# Altium project 0020-03_FFT2G.PrjPcb
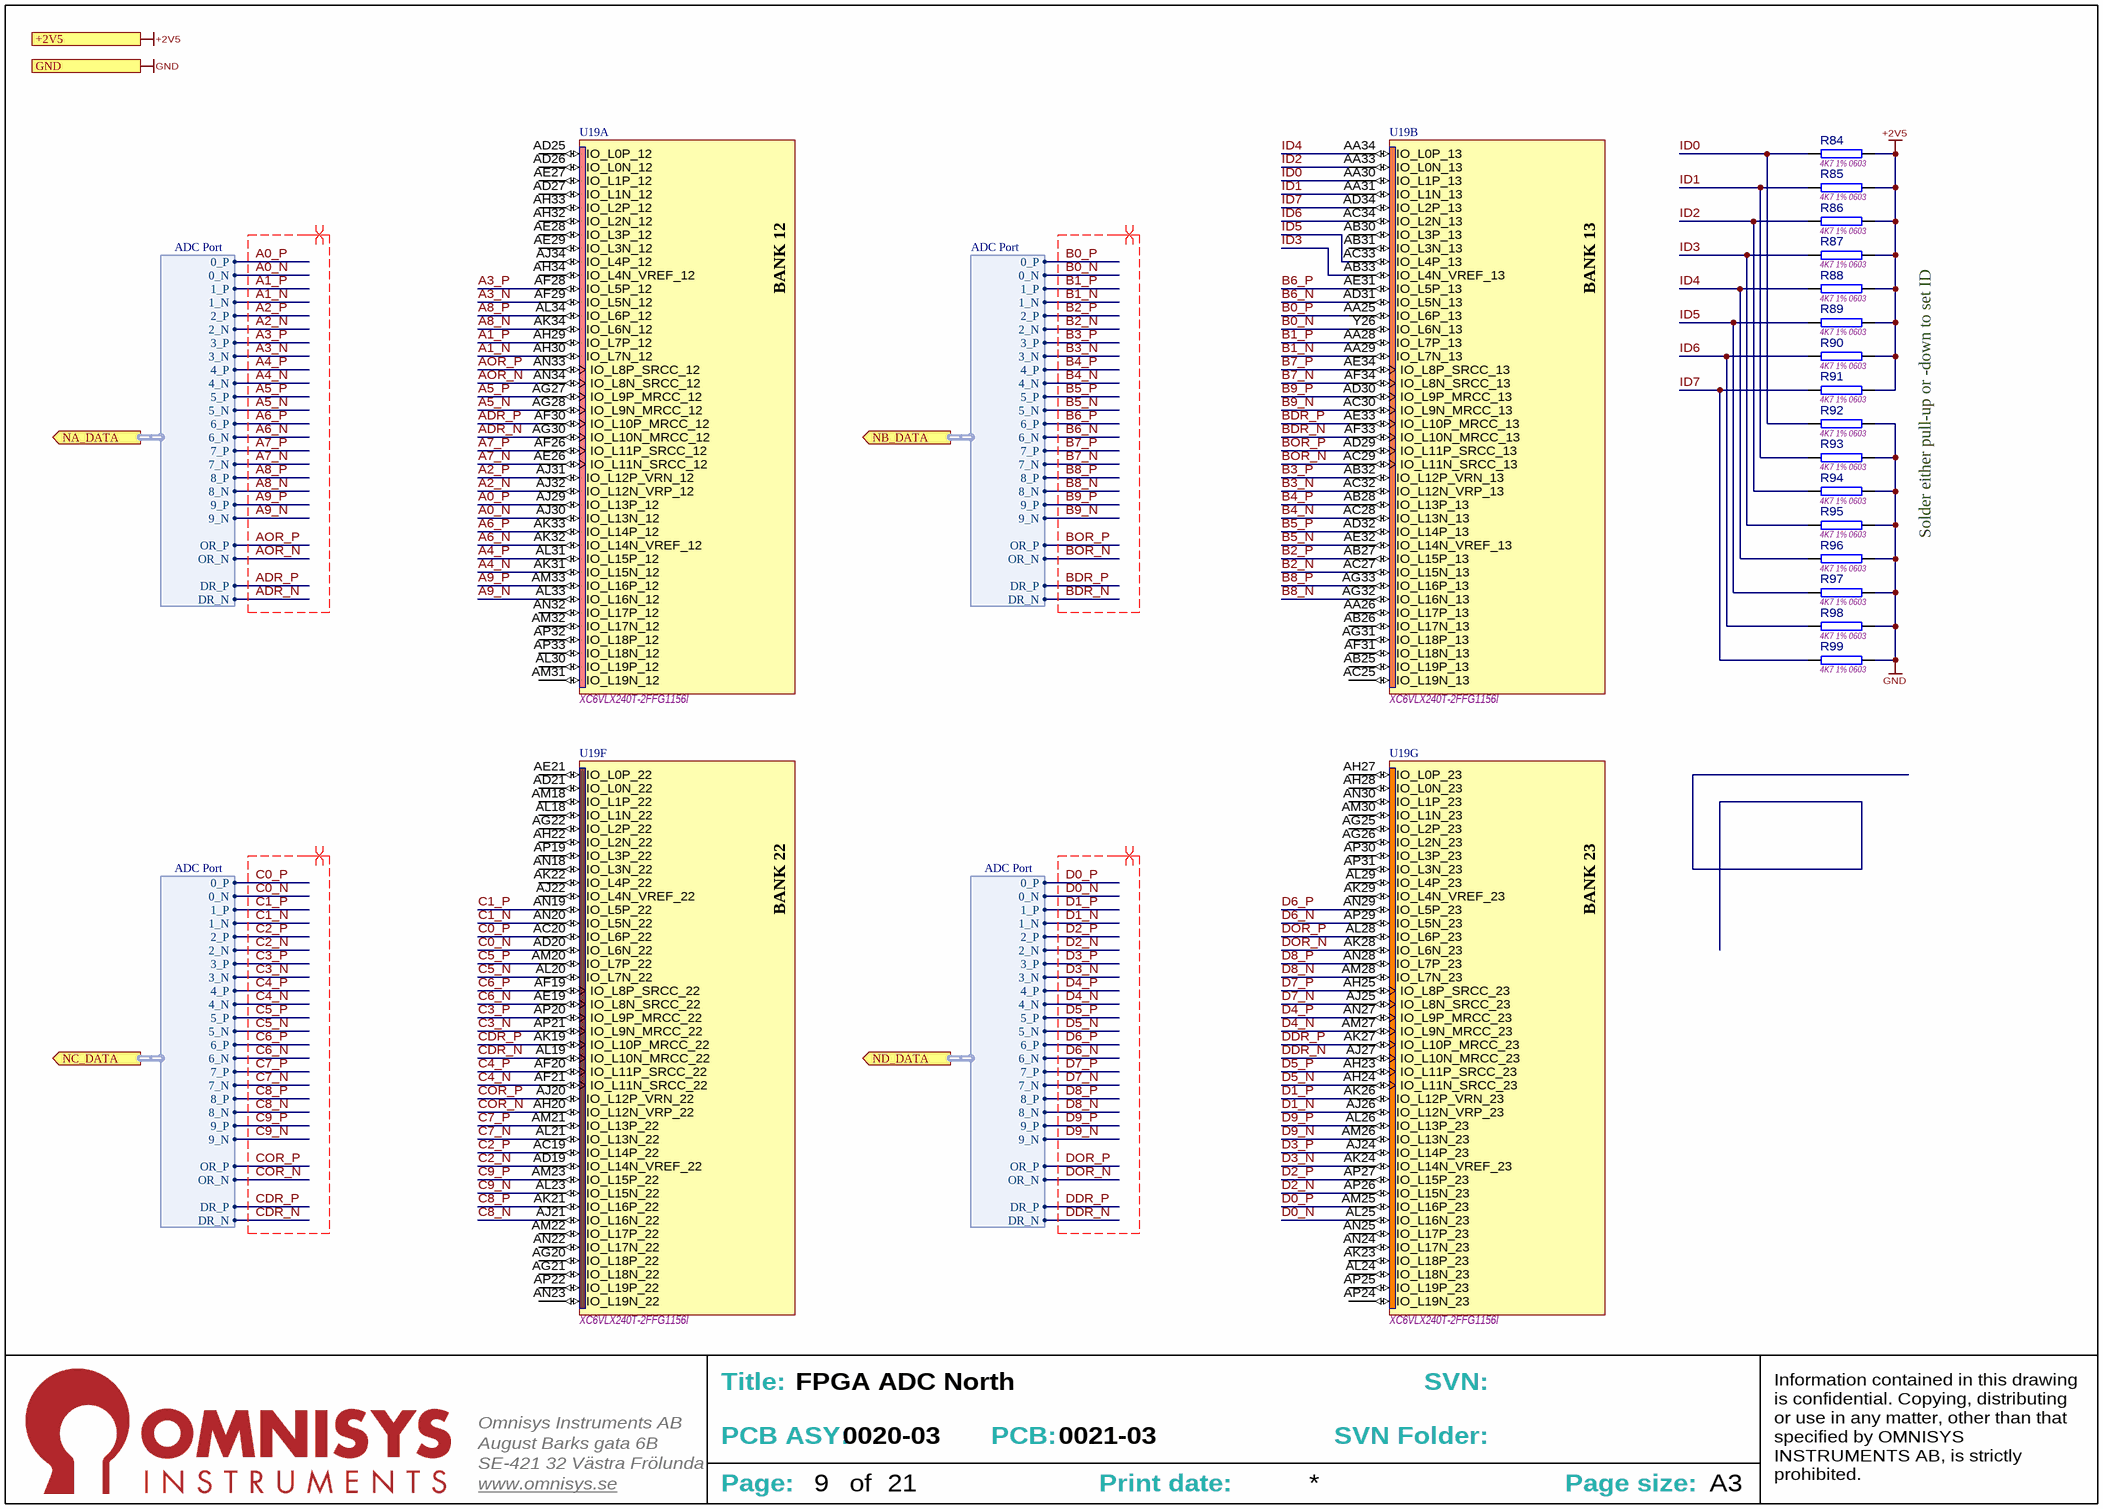
[diagram p0: [9] FPGA_ADC_N.SchDoc]
PCB_Part: 0021-03; PCBASY_Part: 0020-03
4 sheets, 90 parts. Net scope: strictly hierarchical (ports join the sheet entries above them; power ports are local).
Board files: 0020-03_FFT2G.PcbDoc, PCB1.PcbDoc
Sheets:
  [9] FPGA_ADC_N.SchDoc
  [13] FPGA_PWR.SchDoc
  [1] 0020-03_FFT2G - Top.SchDoc
  Sheet1-Renamed123.SchDoc

## Sheet [9] FPGA_ADC_N.SchDoc: FPGA ADC North
size 393 x 281 mm; SheetNumber: 9; SheetTotal: 21; PageSetup: Record=PageOptions|CenterHorizontal=True|CenterVertical=True|PrintScale=0.94|XCorrection=0.00|YCorrection=0.00|PrintKind=0|BorderSize=5000000|LeftOffset=0|BottomOffset=0|Orientation=2|PaperLength=1000|PaperWidth=1000|Scale=100|PaperSource=15|PrintQuality=600|MediaType=1|DitherType=10|PrintScaleMode=1|PaperKind=A4; Adr1: August Barks gata 6B; Adr2: SE-421 32 Västra Frölunda; Adr3: Sweden; Webpage: www.omnisys.se

### Parts
R84  4K7 1% 0603  [RESC1608N]
R85  4K7 1% 0603  [RESC1608N]
R86  4K7 1% 0603  [RESC1608N]
R87  4K7 1% 0603  [RESC1608N]
R88  4K7 1% 0603  [RESC1608N]
R89  4K7 1% 0603  [RESC1608N]
R90  4K7 1% 0603  [RESC1608N]
R91  4K7 1% 0603  [RESC1608N]
R92  4K7 1% 0603  [RESC1608N]
R93  4K7 1% 0603  [RESC1608N]
R94  4K7 1% 0603  [RESC1608N]
R95  4K7 1% 0603  [RESC1608N]
R96  4K7 1% 0603  [RESC1608N]
R97  4K7 1% 0603  [RESC1608N]
R98  4K7 1% 0603  [RESC1608N]
R99  4K7 1% 0603  [RESC1608N]
U19  XC6VLX240T-2FFG1156I  [FFG1156]  (parts A,B,F,G of 20)

### Ports
+2V5, GND, NA_DATA (out, harness ADC Port), NB_DATA (out, harness ADC Port), NC_DATA (out, harness ADC Port), ND_DATA (out, harness ADC Port)

### Harnesses
ADC Port: 0_P, 1_P, 2_P, 3_P, 4_P, 5_P, 6_P, 7_P, 8_P, 9_P, 0_N, 1_N, 2_N, 3_N, 4_N, 5_N, 6_N, 7_N, 8_N, 9_N, OR_P, OR_N, DR_P, DR_N

### Nets
+2V5: R84.1 R85.1 R86.1 R87.1 R88.1 R89.1 R90.1 R91.1 ; port +2V5
GND: R92.1 R93.1 R94.1 R95.1 R96.1 R97.1 R98.1 R99.1 ; port GND
A0_N: U19.AJ30(IO_L13N_12) ; port NA_DATA.0_N
A0_P: U19.AJ29(IO_L13P_12) ; port NA_DATA.0_P
A1_N: U19.AH30(IO_L7N_12) ; port NA_DATA.1_N
A1_P: U19.AH29(IO_L7P_12) ; port NA_DATA.1_P
A2_N: U19.AJ32(IO_L12N_VRP_12) ; port NA_DATA.2_N
A2_P: U19.AJ31(IO_L12P_VRN_12) ; port NA_DATA.2_P
A3_N: U19.AF29(IO_L5N_12) ; port NA_DATA.3_N
A3_P: U19.AF28(IO_L5P_12) ; port NA_DATA.3_P
A4_N: U19.AK31(IO_L15N_12) ; port NA_DATA.4_N
A4_P: U19.AL31(IO_L15P_12) ; port NA_DATA.4_P
A5_N: U19.AG28(IO_L9N_MRCC_12) ; port NA_DATA.5_N
A5_P: U19.AG27(IO_L9P_MRCC_12) ; port NA_DATA.5_P
A6_N: U19.AK32(IO_L14N_VREF_12) ; port NA_DATA.6_N
A6_P: U19.AK33(IO_L14P_12) ; port NA_DATA.6_P
A7_N: U19.AE26(IO_L11N_SRCC_12) ; port NA_DATA.7_N
A7_P: U19.AF26(IO_L11P_SRCC_12) ; port NA_DATA.7_P
A8_N: U19.AK34(IO_L6N_12) ; port NA_DATA.8_N
A8_P: U19.AL34(IO_L6P_12) ; port NA_DATA.8_P
A9_N: U19.AL33(IO_L16N_12) ; port NA_DATA.9_N
A9_P: U19.AM33(IO_L16P_12) ; port NA_DATA.9_P
ADR_N: U19.AG30(IO_L10N_MRCC_12) ; port NA_DATA.DR_N
ADR_P: U19.AF30(IO_L10P_MRCC_12) ; port NA_DATA.DR_P
AOR_N: U19.AN34(IO_L8N_SRCC_12) ; port NA_DATA.OR_N
AOR_P: U19.AN33(IO_L8P_SRCC_12) ; port NA_DATA.OR_P
B0_N: U19.Y26(IO_L6N_13) ; port NB_DATA.0_N
B0_P: U19.AA25(IO_L6P_13) ; port NB_DATA.0_P
B1_N: U19.AA29(IO_L7N_13) ; port NB_DATA.1_N
B1_P: U19.AA28(IO_L7P_13) ; port NB_DATA.1_P
B2_N: U19.AC27(IO_L15N_13) ; port NB_DATA.2_N
B2_P: U19.AB27(IO_L15P_13) ; port NB_DATA.2_P
B3_N: U19.AC32(IO_L12N_VRP_13) ; port NB_DATA.3_N
B3_P: U19.AB32(IO_L12P_VRN_13) ; port NB_DATA.3_P
B4_N: U19.AC28(IO_L13N_13) ; port NB_DATA.4_N
B4_P: U19.AB28(IO_L13P_13) ; port NB_DATA.4_P
B5_N: U19.AE32(IO_L14N_VREF_13) ; port NB_DATA.5_N
B5_P: U19.AD32(IO_L14P_13) ; port NB_DATA.5_P
B6_N: U19.AD31(IO_L5N_13) ; port NB_DATA.6_N
B6_P: U19.AE31(IO_L5P_13) ; port NB_DATA.6_P
B7_N: U19.AF34(IO_L8N_SRCC_13) ; port NB_DATA.7_N
B7_P: U19.AE34(IO_L8P_SRCC_13) ; port NB_DATA.7_P
B8_N: U19.AG32(IO_L16N_13) ; port NB_DATA.8_N
B8_P: U19.AG33(IO_L16P_13) ; port NB_DATA.8_P
B9_N: U19.AC30(IO_L9N_MRCC_13) ; port NB_DATA.9_N
B9_P: U19.AD30(IO_L9P_MRCC_13) ; port NB_DATA.9_P
BDR_N: U19.AF33(IO_L10N_MRCC_13) ; port NB_DATA.DR_N
BDR_P: U19.AE33(IO_L10P_MRCC_13) ; port NB_DATA.DR_P
BOR_N: U19.AC29(IO_L11N_SRCC_13) ; port NB_DATA.OR_N
BOR_P: U19.AD29(IO_L11P_SRCC_13) ; port NB_DATA.OR_P
C0_N: U19.AD20(IO_L6N_22) ; port NC_DATA.0_N
C0_P: U19.AC20(IO_L6P_22) ; port NC_DATA.0_P
C1_N: U19.AN20(IO_L5N_22) ; port NC_DATA.1_N
C1_P: U19.AN19(IO_L5P_22) ; port NC_DATA.1_P
C2_N: U19.AD19(IO_L14N_VREF_22) ; port NC_DATA.2_N
C2_P: U19.AC19(IO_L14P_22) ; port NC_DATA.2_P
C3_N: U19.AP21(IO_L9N_MRCC_22) ; port NC_DATA.3_N
C3_P: U19.AP20(IO_L9P_MRCC_22) ; port NC_DATA.3_P
C4_N: U19.AF21(IO_L11N_SRCC_22) ; port NC_DATA.4_N
C4_P: U19.AF20(IO_L11P_SRCC_22) ; port NC_DATA.4_P
C5_N: U19.AL20(IO_L7N_22) ; port NC_DATA.5_N
C5_P: U19.AM20(IO_L7P_22) ; port NC_DATA.5_P
C6_N: U19.AE19(IO_L8N_SRCC_22) ; port NC_DATA.6_N
C6_P: U19.AF19(IO_L8P_SRCC_22) ; port NC_DATA.6_P
C7_N: U19.AL21(IO_L13N_22) ; port NC_DATA.7_N
C7_P: U19.AM21(IO_L13P_22) ; port NC_DATA.7_P
C8_N: U19.AJ21(IO_L16N_22) ; port NC_DATA.8_N
C8_P: U19.AK21(IO_L16P_22) ; port NC_DATA.8_P
C9_N: U19.AL23(IO_L15N_22) ; port NC_DATA.9_N
C9_P: U19.AM23(IO_L15P_22) ; port NC_DATA.9_P
CDR_N: U19.AL19(IO_L10N_MRCC_22) ; port NC_DATA.DR_N
CDR_P: U19.AK19(IO_L10P_MRCC_22) ; port NC_DATA.DR_P
COR_N: U19.AH20(IO_L12N_VRP_22) ; port NC_DATA.OR_N
COR_P: U19.AJ20(IO_L12P_VRN_22) ; port NC_DATA.OR_P
D0_N: U19.AL25(IO_L16N_23) ; port ND_DATA.0_N
D0_P: U19.AM25(IO_L16P_23) ; port ND_DATA.0_P
D1_N: U19.AJ26(IO_L12N_VRP_23) ; port ND_DATA.1_N
D1_P: U19.AK26(IO_L12P_VRN_23) ; port ND_DATA.1_P
D2_N: U19.AP26(IO_L15N_23) ; port ND_DATA.2_N
D2_P: U19.AP27(IO_L15P_23) ; port ND_DATA.2_P
D3_N: U19.AK24(IO_L14N_VREF_23) ; port ND_DATA.3_N
D3_P: U19.AJ24(IO_L14P_23) ; port ND_DATA.3_P
D4_N: U19.AM27(IO_L9N_MRCC_23) ; port ND_DATA.4_N
D4_P: U19.AN27(IO_L9P_MRCC_23) ; port ND_DATA.4_P
D5_N: U19.AH24(IO_L11N_SRCC_23) ; port ND_DATA.5_N
D5_P: U19.AH23(IO_L11P_SRCC_23) ; port ND_DATA.5_P
D6_N: U19.AP29(IO_L5N_23) ; port ND_DATA.6_N
D6_P: U19.AN29(IO_L5P_23) ; port ND_DATA.6_P
D7_N: U19.AJ25(IO_L8N_SRCC_23) ; port ND_DATA.7_N
D7_P: U19.AH25(IO_L8P_SRCC_23) ; port ND_DATA.7_P
D8_N: U19.AM28(IO_L7N_23) ; port ND_DATA.8_N
D8_P: U19.AN28(IO_L7P_23) ; port ND_DATA.8_P
D9_N: U19.AM26(IO_L13N_23) ; port ND_DATA.9_N
D9_P: U19.AL26(IO_L13P_23) ; port ND_DATA.9_P
DDR_N: U19.AJ27(IO_L10N_MRCC_23) ; port ND_DATA.DR_N
DDR_P: U19.AK27(IO_L10P_MRCC_23) ; port ND_DATA.DR_P
DOR_N: U19.AK28(IO_L6N_23) ; port ND_DATA.OR_N
DOR_P: U19.AL28(IO_L6P_23) ; port ND_DATA.OR_P
ID0: R84.2 R92.2 U19.AA30(IO_L1P_13)
ID1: R85.2 R93.2 U19.AA31(IO_L1N_13)
ID2: R86.2 R94.2 U19.AA33(IO_L0N_13)
ID3: R87.2 R95.2 U19.AB33(IO_L4N_VREF_13)
ID4: R88.2 R96.2 U19.AA34(IO_L0P_13)
ID5: R89.2 R97.2 U19.AC33(IO_L4P_13)
ID6: R90.2 R98.2 U19.AC34(IO_L2N_13)
ID7: R91.2 R99.2 U19.AD34(IO_L2P_13)

Not connected (* = marked no-connect by the designer): U19 AA26(IO_L17P_13) AB25(IO_L19P_13) AB26(IO_L17N_13) AB30(IO_L3P_13) AB31(IO_L3N_13) AC25(IO_L19N_13) AD21(IO_L0N_22) AD25(IO_L0P_12) AD26(IO_L0N_12) AD27(IO_L1N_12) AE21(IO_L0P_22) AE27(IO_L1P_12) AE28(IO_L3P_12) AE29(IO_L3N_12) AF31(IO_L18N_13) AG20(IO_L18P_22) AG21(IO_L18N_22) AG22(IO_L2P_22) AG25(IO_L2P_23) AG26(IO_L2N_23) AG31(IO_L18P_13) AH22(IO_L2N_22) AH27(IO_L0P_23) AH28(IO_L0N_23) AH32(IO_L2N_12) AH33(IO_L2P_12) AH34(IO_L4N_VREF_12) AJ22(IO_L4N_VREF_22) AJ34(IO_L4P_12) AK22(IO_L4P_22) AK23(IO_L18P_23) AK29(IO_L4N_VREF_23) AL18(IO_L1N_22) AL24(IO_L18N_23) AL29(IO_L4P_23) AL30(IO_L19P_12) AM18(IO_L1P_22) AM22(IO_L17P_22) AM30(IO_L1N_23) AM31(IO_L19N_12) AM32(IO_L17N_12) AN18(IO_L3N_22) AN22(IO_L17N_22) AN23(IO_L19N_22) AN24(IO_L17N_23) AN25(IO_L17P_23) AN30(IO_L1P_23) AN32(IO_L17P_12) AP19(IO_L3P_22) AP22(IO_L19P_22) AP24(IO_L19N_23) AP25(IO_L19P_23) AP30(IO_L3P_23) AP31(IO_L3N_23) AP32(IO_L18P_12) AP33(IO_L18N_12)

### Layout directives
differential pair; rule Differential Pairs Routing [Pref Gap = 0.1mm    Min Gap  = 0.1mm    Max Gap  = 0.1mmPref Width = 0.1mm    Min Width  = 0.1mm    Max Width  = 0.1mm]; net class DiffPairs_FPGA: A0_N, A0_P, A1_N, A1_P, A2_N, A2_P, A3_N, A3_P, A4_N, A4_P, A5_N, A5_P, A6_N, A6_P, A7_N, A7_P, A8_N, A8_P, A9_N, A9_P, ADR_N, ADR_P, AOR_N, AOR_P, B0_N, B0_P, B1_N, B1_P, B2_N, B2_P, B3_N, B3_P, B4_N, B4_P, B5_N, B5_P, B6_N, B6_P, B7_N, B7_P, B8_N, B8_P, B9_N, B9_P, BDR_N, BDR_P, BOR_N, BOR_P, C0_N, C0_P, C1_N, C1_P, C2_N, C2_P, C3_N, C3_P, C4_N, C4_P, C5_N, C5_P, C6_N, C6_P, C7_N, C7_P, C8_N, C8_P, C9_N, C9_P, CDR_N, CDR_P, COR_N, COR_P, D0_N, D0_P, D1_N, D1_P, D2_N, D2_P, D3_N, D3_P, D4_N, D4_P, D5_N, D5_P, D6_N, D6_P, D7_N, D7_P, D8_N, D8_P, D9_N, D9_P, DDR_N, DDR_P, DOR_N, DOR_P

### Notes on the sheet
- Solder either pull-up or -down to set ID
- Title:
- SVN:
- August Barks gata 6B
- SE-421 32 Västra Frölunda
- Omnisys Instruments AB
- PCB ASY:
- PCB:
- SVN Folder:
- www.omnisys.se
- Page:
- of
- Print date:
- Page size:
- A3
- Information contained in this drawing is confidential. Copying, distributing or use in any matter, other than that specified by OMNISYS INSTRUMENTS AB, is strictly prohibited.
- (in symbol CMP-2100-000586-1, part A) BANK 12
- (in symbol CMP-2100-000586-1, part B) BANK 13
- (in symbol CMP-2100-000586-1, part F) BANK 22
- (in symbol CMP-2100-000586-1, part G) BANK 23

### Library data of the parts
R84-R99 = CMP-1800-002037-5: Thick film Chip Resistor, 0603/1608; Value: 4.7k; Power: 100mW; Maximum working voltage: 75V; Temp. Coefficent: 0.01%; Tolerance: 1%; Case/Package: 0603/1608; Composition: Thick film
U19 = CMP-2100-000586-1: FPGA Virtex-6 LXT Family 241152 Cells 40nm (CMOS) Technology 1V 1156-Pin FCBGA; Number of I/Os: 600; Number of Logic Blocks (LABs): 18840; Number of Logic Elements/Cells: 241152; RAM Size: 15335424b; Speed Grade: 2; Case/Package: FCBGA; Max Operating Temperature: 100°C; Min Operating Temperature: -40°C; Mount: Surface Mount; Number of Pins: 1156; Operating Supply Voltage: 1V; Package Quantity: 1

## Sheet [13] FPGA_PWR.SchDoc: FPGA Power
size 393 x 281 mm; SheetNumber: 13; SheetTotal: 21; PageSetup: Record=PageOptions|CenterHorizontal=True|CenterVertical=True|PrintScale=0.94|XCorrection=0.00|YCorrection=0.00|PrintKind=0|BorderSize=5000000|LeftOffset=0|BottomOffset=0|Orientation=2|PaperLength=1000|PaperWidth=1000|Scale=100|PaperSource=15|PrintQuality=600|MediaType=1|DitherType=10|PrintScaleMode=1|PaperKind=A4; Adr1: August Barks gata 6B; Adr2: SE-421 32 Västra Frölunda; Adr3: Sweden; Webpage: www.omnisys.se
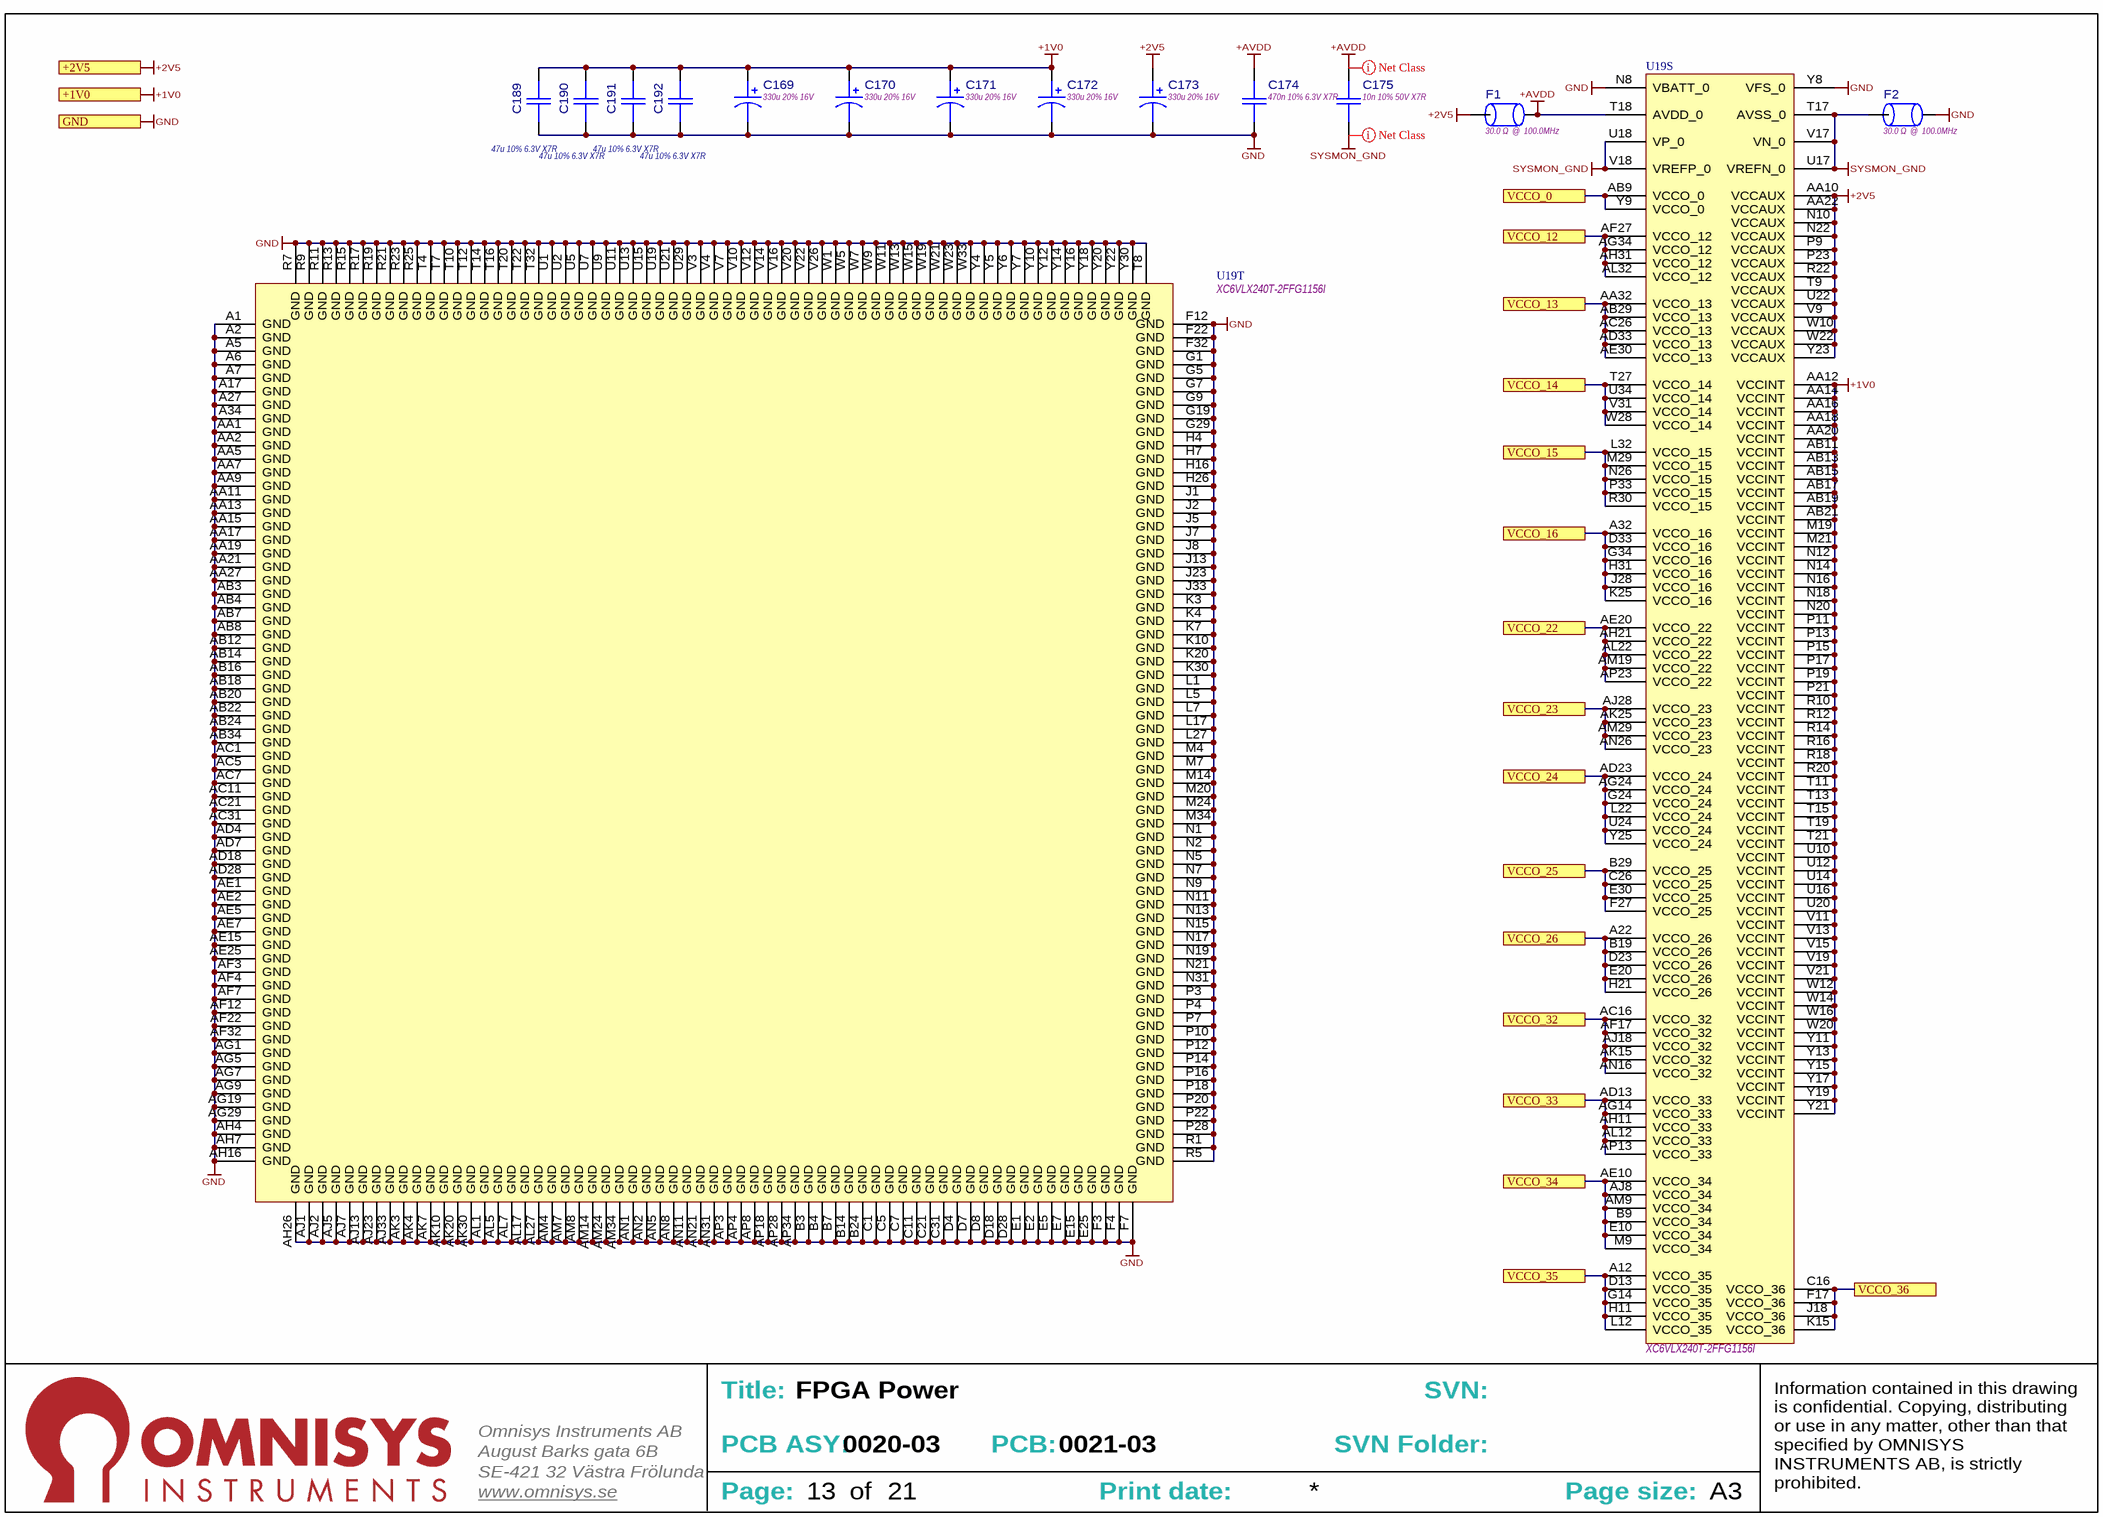
[diagram p1: [13] FPGA_PWR.SchDoc]

### Parts
C169  330u 20% 16V  [CAPMP7343X43N]
C170  330u 20% 16V  [CAPMP7343X43N]
C171  330u 20% 16V  [CAPMP7343X43N]
C172  330u 20% 16V  [CAPMP7343X43N]
C173  330u 20% 16V  [CAPMP7343X43N]
C174  470n 10% 6.3V X7R  [CAPC1608X90N]
C175  10n 10% 50V X7R  [CAPC1608X90N]
C189  47u 10% 6.3V X7R  [CAPC3225X270N]
C190  47u 10% 6.3V X7R  [CAPC3225X270N]
C191  47u 10% 6.3V X7R  [CAPC3225X270N]
C192  47u 10% 6.3V X7R  [CAPC3225X270N]
F1  30.0 Ω  @  100.0MHz  [INDC2012X11L]
F2  30.0 Ω  @  100.0MHz  [INDC2012X11L]
U19  XC6VLX240T-2FFG1156I  [FFG1156]  (parts S,T of 20)

### Ports
+1V0, +2V5, GND, VCCO_0, VCCO_12, VCCO_13, VCCO_14, VCCO_15, VCCO_16, VCCO_22, VCCO_23, VCCO_24, VCCO_25, VCCO_26, VCCO_32, VCCO_33, VCCO_34, VCCO_35, VCCO_36

### Nets
+1V0: C169.1 C170.1 C171.1 C172.1 C189.1 C190.1 C191.1 C192.1 U19.AA12(VCCINT) U19.AA14(VCCINT) U19.AA16(VCCINT) U19.AA18(VCCINT) U19.AA20(VCCINT) U19.AB11(VCCINT) U19.AB13(VCCINT) U19.AB15(VCCINT) U19.AB17(VCCINT) U19.AB19(VCCINT) U19.AB21(VCCINT) U19.M19(VCCINT) U19.M21(VCCINT) U19.N12(VCCINT) U19.N14(VCCINT) U19.N16(VCCINT) U19.N18(VCCINT) U19.N20(VCCINT) U19.P11(VCCINT) U19.P13(VCCINT) U19.P15(VCCINT) U19.P17(VCCINT) U19.P19(VCCINT) U19.P21(VCCINT) U19.R10(VCCINT) U19.R12(VCCINT) U19.R14(VCCINT) U19.R16(VCCINT) U19.R18(VCCINT) U19.R20(VCCINT) U19.T11(VCCINT) U19.T13(VCCINT) U19.T15(VCCINT) U19.T19(VCCINT) U19.T21(VCCINT) U19.U10(VCCINT) U19.U12(VCCINT) U19.U14(VCCINT) U19.U16(VCCINT) U19.U20(VCCINT) U19.V11(VCCINT) U19.V13(VCCINT) U19.V15(VCCINT) U19.V19(VCCINT) U19.V21(VCCINT) U19.W12(VCCINT) U19.W14(VCCINT) U19.W16(VCCINT) U19.W20(VCCINT) U19.Y11(VCCINT) U19.Y13(VCCINT) U19.Y15(VCCINT) U19.Y17(VCCINT) U19.Y19(VCCINT) U19.Y21(VCCINT) ; port +1V0
+2V5: C173.1 F1.1 U19.AA10(VCCAUX) U19.AA22(VCCAUX) U19.N10(VCCAUX) U19.N22(VCCAUX) U19.P9(VCCAUX) U19.P23(VCCAUX) U19.R22(VCCAUX) U19.T9(VCCAUX) U19.U22(VCCAUX) U19.V9(VCCAUX) U19.W10(VCCAUX) U19.W22(VCCAUX) U19.Y23(VCCAUX) ; port +2V5
+AVDD: C174.1 C175.1 F1.2 U19.T18(AVDD_0)
GND: C169.2 C170.2 C171.2 C172.2 C173.2 C174.2 C189.2 C190.2 C191.2 C192.2 F2.2 U19.A1(GND) U19.A2(GND) U19.A5(GND) U19.A6(GND) U19.A7(GND) U19.A17(GND) U19.A27(GND) U19.A34(GND) U19.AA1(GND) U19.AA2(GND) U19.AA5(GND) U19.AA7(GND) U19.AA9(GND) U19.AA11(GND) U19.AA13(GND) U19.AA15(GND) U19.AA17(GND) U19.AA19(GND) U19.AA21(GND) U19.AA27(GND) U19.AB3(GND) U19.AB4(GND) U19.AB7(GND) U19.AB8(GND) U19.AB12(GND) U19.AB14(GND) U19.AB16(GND) U19.AB18(GND) U19.AB20(GND) U19.AB22(GND) U19.AB24(GND) U19.AB34(GND) U19.AC1(GND) U19.AC5(GND) U19.AC7(GND) U19.AC11(GND) U19.AC21(GND) U19.AC31(GND) U19.AD4(GND) U19.AD7(GND) U19.AD18(GND) U19.AD28(GND) U19.AE1(GND) U19.AE2(GND) U19.AE5(GND) U19.AE7(GND) U19.AE15(GND) U19.AE25(GND) U19.AF3(GND) U19.AF4(GND) U19.AF7(GND) U19.AF12(GND) U19.AF22(GND) U19.AF32(GND) U19.AG1(GND) U19.AG5(GND) U19.AG7(GND) U19.AG9(GND) U19.AG19(GND) U19.AG29(GND) U19.AH4(GND) U19.AH7(GND) U19.AH16(GND) U19.AH26(GND) U19.AJ1(GND) U19.AJ2(GND) U19.AJ5(GND) U19.AJ7(GND) U19.AJ13(GND) U19.AJ23(GND) U19.AJ33(GND) U19.AK3(GND) U19.AK4(GND) U19.AK7(GND) U19.AK10(GND) U19.AK20(GND) U19.AK30(GND) U19.AL1(GND) U19.AL5(GND) U19.AL7(GND) U19.AL17(GND) U19.AL27(GND) U19.AM4(GND) U19.AM7(GND) U19.AM8(GND) U19.AM14(GND) U19.AM24(GND) U19.AM34(GND) U19.AN1(GND) U19.AN2(GND) U19.AN5(GND) U19.AN8(GND) U19.AN11(GND) U19.AN21(GND) U19.AN31(GND) U19.AP3(GND) U19.AP4(GND) U19.AP8(GND) U19.AP18(GND) U19.AP28(GND) U19.AP34(GND) U19.B3(GND) U19.B4(GND) U19.B7(GND) U19.B14(GND) U19.B24(GND) U19.C1(GND) U19.C5(GND) U19.C7(GND) U19.C11(GND) U19.C21(GND) U19.C31(GND) U19.D4(GND) U19.D7(GND) U19.D8(GND) U19.D18(GND) U19.D28(GND) U19.E1(GND) U19.E2(GND) U19.E5(GND) U19.E7(GND) U19.E15(GND) U19.E25(GND) U19.F3(GND) U19.F4(GND) U19.F7(GND) U19.F12(GND) U19.F22(GND) U19.F32(GND) U19.G1(GND) U19.G5(GND) U19.G7(GND) U19.G9(GND) U19.G19(GND) U19.G29(GND) U19.H4(GND) U19.H7(GND) U19.H16(GND) U19.H26(GND) U19.J1(GND) U19.J2(GND) U19.J5(GND) U19.J7(GND) U19.J8(GND) U19.J13(GND) U19.J23(GND) U19.J33(GND) U19.K3(GND) U19.K4(GND) U19.K7(GND) U19.K10(GND) U19.K20(GND) U19.K30(GND) U19.L1(GND) U19.L5(GND) U19.L7(GND) U19.L17(GND) U19.L27(GND) U19.M4(GND) U19.M7(GND) U19.M14(GND) U19.M20(GND) U19.M24(GND) U19.M34(GND) U19.N1(GND) U19.N2(GND) U19.N5(GND) U19.N7(GND) U19.N8(VBATT_0) U19.N9(GND) U19.N11(GND) U19.N13(GND) U19.N15(GND) U19.N17(GND) U19.N19(GND) U19.N21(GND) U19.N31(GND) U19.P3(GND) U19.P4(GND) U19.P7(GND) U19.P10(GND) U19.P12(GND) U19.P14(GND) U19.P16(GND) U19.P18(GND) U19.P20(GND) U19.P22(GND) U19.P28(GND) U19.R1(GND) U19.R5(GND) U19.R7(GND) U19.R9(GND) U19.R11(GND) U19.R13(GND) U19.R15(GND) U19.R17(GND) U19.R19(GND) U19.R21(GND) U19.R23(GND) U19.R25(GND) U19.T4(GND) U19.T7(GND) U19.T8(GND) U19.T10(GND) U19.T12(GND) U19.T14(GND) U19.T16(GND) U19.T20(GND) U19.T22(GND) U19.T32(GND) U19.U1(GND) U19.U2(GND) U19.U5(GND) U19.U7(GND) U19.U9(GND) U19.U11(GND) U19.U13(GND) U19.U15(GND) U19.U19(GND) U19.U21(GND) U19.U29(GND) U19.V3(GND) U19.V4(GND) U19.V7(GND) U19.V10(GND) U19.V12(GND) U19.V14(GND) U19.V16(GND) U19.V20(GND) U19.V22(GND) U19.V26(GND) U19.W1(GND) U19.W5(GND) U19.W7(GND) U19.W9(GND) U19.W11(GND) U19.W13(GND) U19.W15(GND) U19.W19(GND) U19.W21(GND) U19.W23(GND) U19.W33(GND) U19.Y4(GND) U19.Y5(GND) U19.Y6(GND) U19.Y7(GND) U19.Y8(VFS_0) U19.Y10(GND) U19.Y12(GND) U19.Y14(GND) U19.Y16(GND) U19.Y18(GND) U19.Y20(GND) U19.Y22(GND) U19.Y30(GND) ; port GND
SYSMON_GND: C175.2 F2.1 U19.T17(AVSS_0) U19.U17(VREFN_0) U19.U18(VP_0) U19.V17(VN_0) U19.V18(VREFP_0)
NetU19_A12: U19.A12(VCCO_35) U19.D13(VCCO_35) U19.G14(VCCO_35) U19.H11(VCCO_35) U19.L12(VCCO_35) ; port VCCO_35
NetU19_A22: U19.A22(VCCO_26) U19.B19(VCCO_26) U19.D23(VCCO_26) U19.E20(VCCO_26) U19.H21(VCCO_26) ; port VCCO_26
NetU19_A32: U19.A32(VCCO_16) U19.D33(VCCO_16) U19.G34(VCCO_16) U19.H31(VCCO_16) U19.J28(VCCO_16) U19.K25(VCCO_16) ; port VCCO_16
NetU19_AA32: U19.AA32(VCCO_13) U19.AB29(VCCO_13) U19.AC26(VCCO_13) U19.AD33(VCCO_13) U19.AE30(VCCO_13) ; port VCCO_13
NetU19_AB9: U19.AB9(VCCO_0) U19.Y9(VCCO_0) ; port VCCO_0
NetU19_AC16: U19.AC16(VCCO_32) U19.AF17(VCCO_32) U19.AJ18(VCCO_32) U19.AK15(VCCO_32) U19.AN16(VCCO_32) ; port VCCO_32
NetU19_AD13: U19.AD13(VCCO_33) U19.AG14(VCCO_33) U19.AH11(VCCO_33) U19.AL12(VCCO_33) U19.AP13(VCCO_33) ; port VCCO_33
NetU19_AD23: U19.AD23(VCCO_24) U19.AG24(VCCO_24) U19.G24(VCCO_24) U19.L22(VCCO_24) U19.U24(VCCO_24) U19.Y25(VCCO_24) ; port VCCO_24
NetU19_AE10: U19.AE10(VCCO_34) U19.AJ8(VCCO_34) U19.AM9(VCCO_34) U19.B9(VCCO_34) U19.E10(VCCO_34) U19.M9(VCCO_34) ; port VCCO_34
NetU19_AE20: U19.AE20(VCCO_22) U19.AH21(VCCO_22) U19.AL22(VCCO_22) U19.AM19(VCCO_22) U19.AP23(VCCO_22) ; port VCCO_22
NetU19_AF27: U19.AF27(VCCO_12) U19.AG34(VCCO_12) U19.AH31(VCCO_12) U19.AL32(VCCO_12) ; port VCCO_12
NetU19_AJ28: U19.AJ28(VCCO_23) U19.AK25(VCCO_23) U19.AM29(VCCO_23) U19.AN26(VCCO_23) ; port VCCO_23
NetU19_B29: U19.B29(VCCO_25) U19.C26(VCCO_25) U19.E30(VCCO_25) U19.F27(VCCO_25) ; port VCCO_25
NetU19_C16: U19.C16(VCCO_36) U19.F17(VCCO_36) U19.J18(VCCO_36) U19.K15(VCCO_36) ; port VCCO_36
NetU19_L32: U19.L32(VCCO_15) U19.M29(VCCO_15) U19.N26(VCCO_15) U19.P33(VCCO_15) U19.R30(VCCO_15) ; port VCCO_15
NetU19_T27: U19.T27(VCCO_14) U19.U34(VCCO_14) U19.V31(VCCO_14) U19.W28(VCCO_14) ; port VCCO_14

### Layout directives
net class Power: +AVDD, SYSMON_GND

### Notes on the sheet
- Title:
- SVN:
- August Barks gata 6B
- SE-421 32 Västra Frölunda
- Omnisys Instruments AB
- PCB ASY:
- PCB:
- SVN Folder:
- www.omnisys.se
- Page:
- of
- Print date:
- Page size:
- A3
- Information contained in this drawing is confidential. Copying, distributing or use in any matter, other than that specified by OMNISYS INSTRUMENTS AB, is strictly prohibited.

### Library data of the parts
C169-C173 = CMP-0300-000208-8: Standard tantalum capacitor, 7343/Case E; ESR: 0.4; Capacitance: 330µF; DCL: 52.8A; DF: 30%; Tolerance: 20%; Rated Voltage: 16V; Case/Package: 7343
C174 = CMP-0300-002107-6: Ceramic Chip Capacitor, 0603/1608; Capacitance: 470nF; Package: 1608/0603; Temperature Charateristics: X7R; Tolerance: 10%; Rated Voltage: 6.3V; Thickness: 900µm; Weight: 9mg
C175 = CMP-0300-002475-6: Ceramic Chip Capacitor, 0603/1608; Temperature Charateristics: C0G; Tolerance: 5%; Capacitance: 10nF; Package: 1608/0603; Rated Voltage: 50V; Thickness: 900µm; Weight: 9mg
C189-C192 = CMP-0300-002062-5: Ceramic Chip Capacitor, 1210/3225; Capacitance: 47µF; Temperature Charateristics: X7R; Tolerance: 10%; Thickness: 2.7mm; Case/Package: 1210/3225; Rated Voltage: 6.3V
F1 F2 = CMP-0600-000010-2: Ferrite bead, Würth Elektronik WE-CBF 2012 (0805), 74279206 ,  30.0 Ω  @  100.0MHz; Zmax@Freq: 55.0 Ω  @      1.0 GHz; Type: High Current; RDC: 25.0 mΩ; IDC: 3.0 A; Z@Freq: 30.0 Ω  @  100.0MHz; PartNumber: 74279206
U19 = CMP-2100-000586-1: as U19 on sheet [9] FPGA_ADC_N; Case/Package: FCBGA; Max Operating Temperature: 100°C; Min Operating Temperature: -40°C; Mount: Surface Mount; Number of Pins: 1156; Operating Supply Voltage: 1V; Package Quantity: 1

## Sheet [1] 0020-03_FFT2G - Top.SchDoc: FFT-Top
size 393 x 281 mm; Notes: No notes; Part_And_Rev: 0000-00; Drawing_Configuration: No Configuration; SheetNumber: 1; SheetTotal: 21; CompanyName: Omnisys Instruments AB; DrawnBy: Enter Name; PageSetup: Record=PageOptions|CenterHorizontal=True|CenterVertical=True|PrintScale=0.94|XCorrection=0.00|YCorrection=0.00|PrintKind=0|BorderSize=5000000|LeftOffset=0|BottomOffset=0|Orientation=2|PaperLength=1000|PaperWidth=1000|Scale=100|PaperSource=15|PrintQuality=-3|MediaType=1|DitherType=10|PrintScaleMode=1|PaperKind=10" x 14"|PaperIndex=16; Adr1: August Barks gata 6B; Adr2: SE-421 32 Västra Frölunda; Adr3: Sweden; Webpage: www.omnisys.se
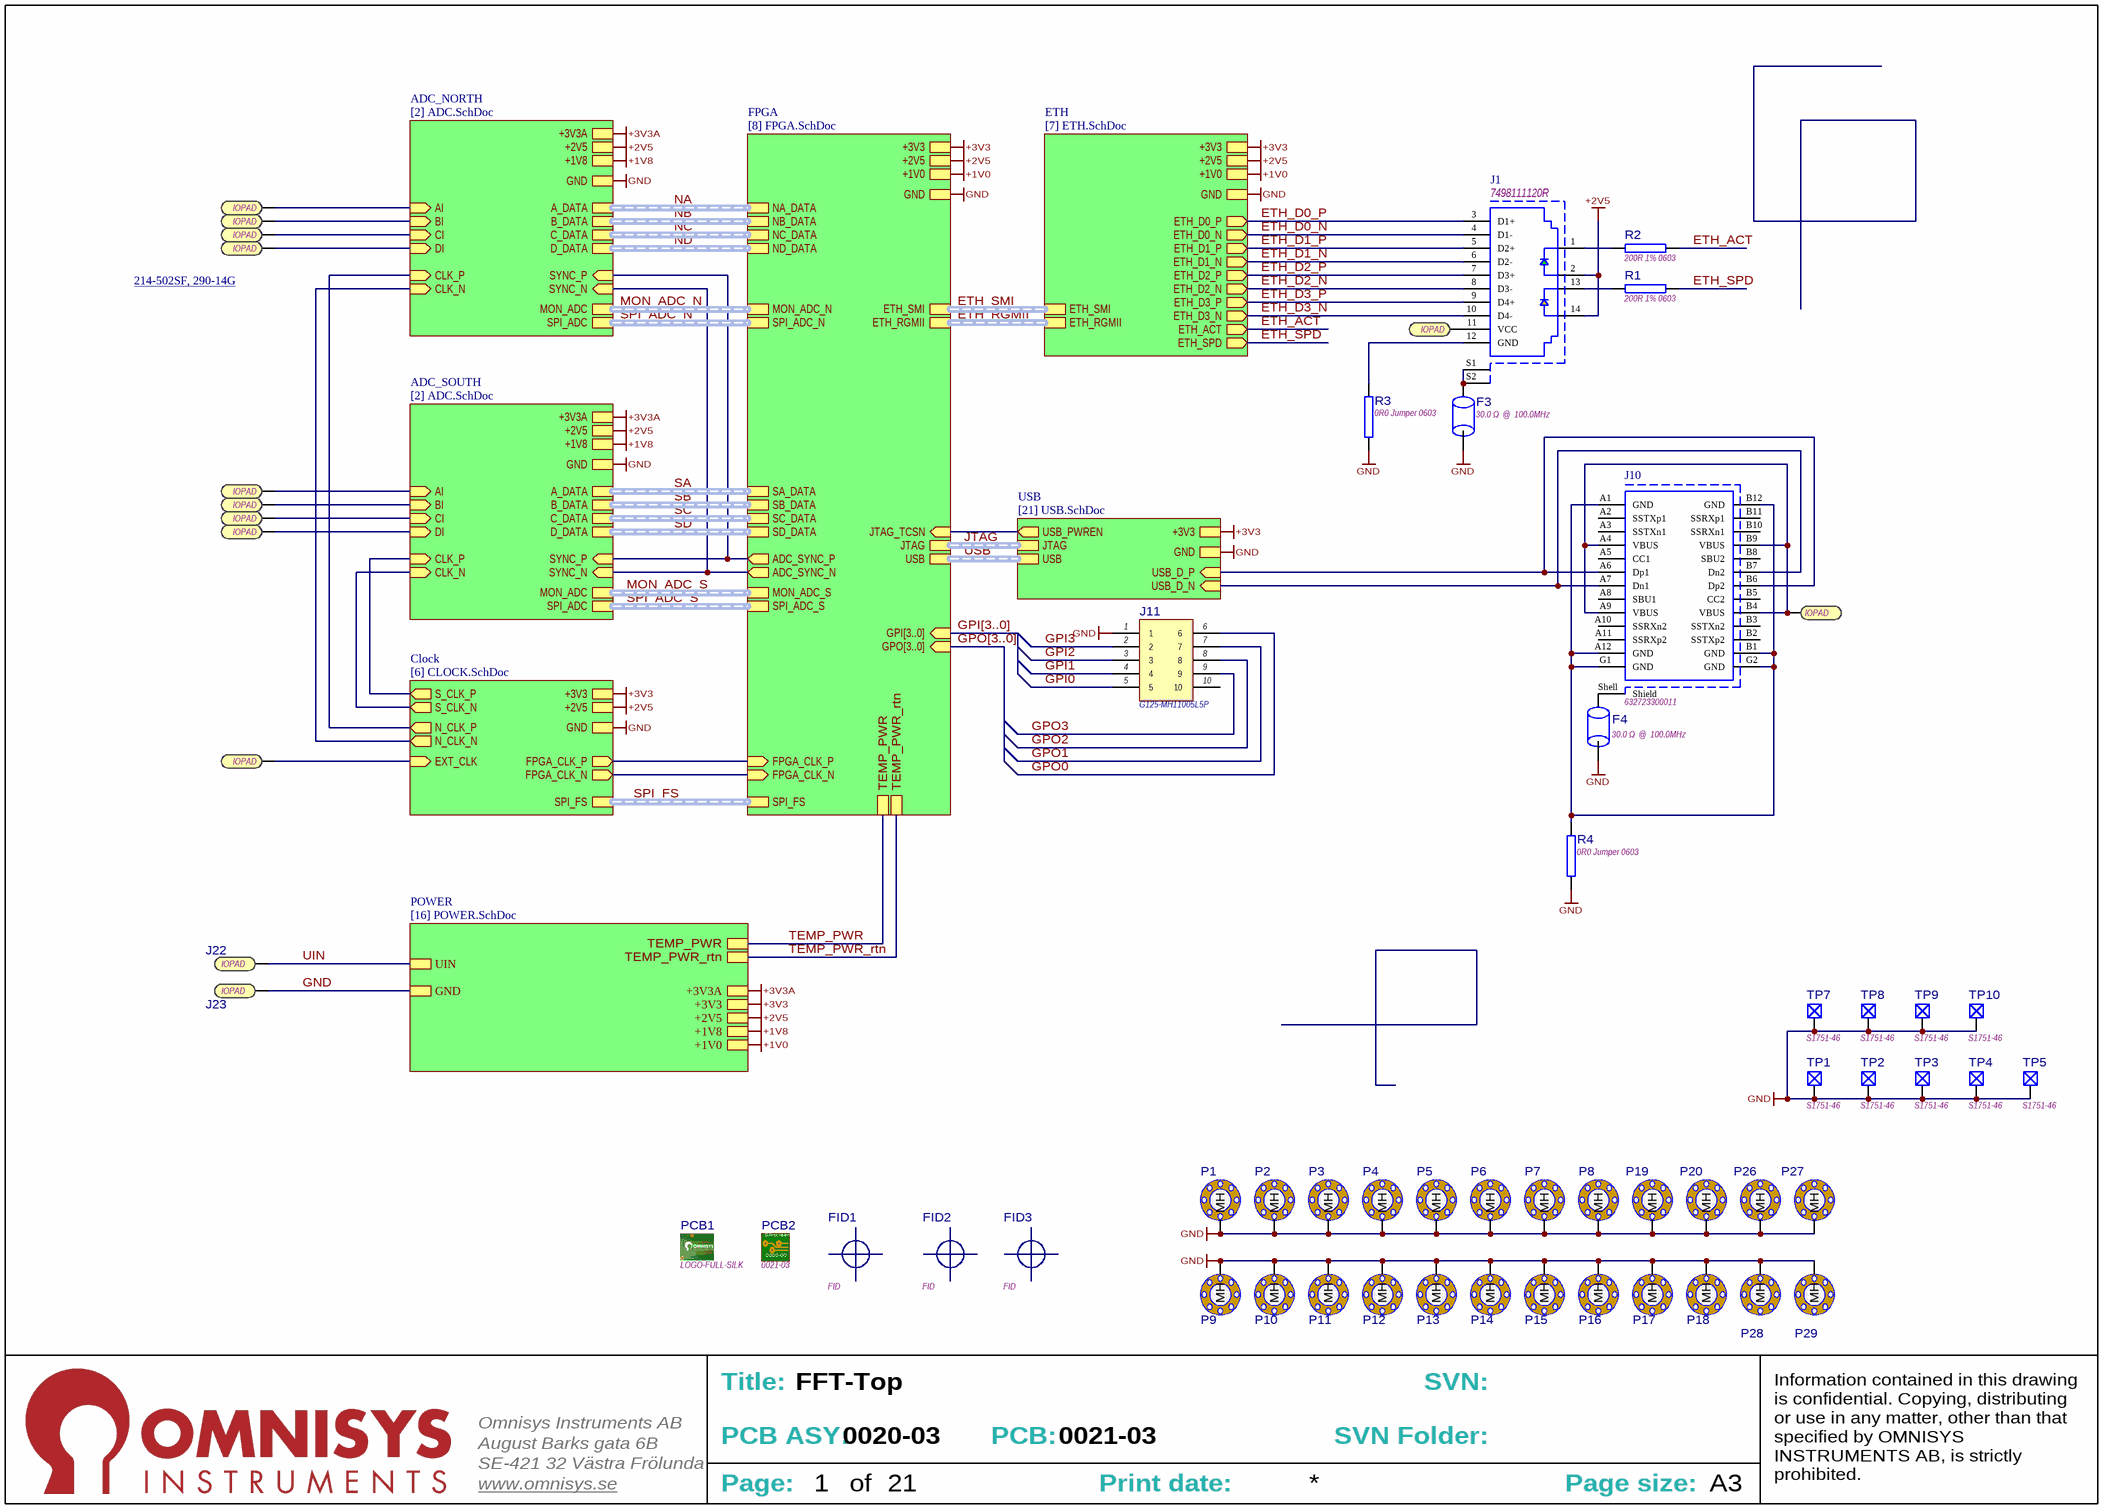
[diagram p2: [1] 0020-03_FFT2G - Top.SchDoc]

### Parts
F3  30.0 Ω  @  100.0MHz  [INDC2012X11N]
F4  30.0 Ω  @  100.0MHz  [INDC2012X11N]
FID1  FID  [FID]
FID2  FID  [FID]
FID3  FID  [FID]
J1  7498111120R  [7498111120R-Footprint-1]
J2  IOPAD  [SMT_IO_PAD_0.5x0.5MM]  (no BOM)
J3  IOPAD  [SMT_IO_PAD_0.5x0.5MM]  (no BOM)
J4  IOPAD  [SMT_IO_PAD_0.5x0.5MM]  (no BOM)
J5  IOPAD  [SMT_IO_PAD_0.5x0.5MM]  (no BOM)
J6  IOPAD  [SMT_IO_PAD_0.5x0.5MM]  (no BOM)
J7  IOPAD  [SMT_IO_PAD_0.5x0.5MM]  (no BOM)
J8  IOPAD  [SMT_IO_PAD_0.5x0.5MM]  (no BOM)
J9  IOPAD  [SMT_IO_PAD_0.5x0.5MM]  (no BOM)
J10  632723300011  [632723300011]
J11  G125-MH11005L5P  [G125-MH11005L5P-Footprint-1]
J15  IOPAD  [SMT_IO_PAD_0.5x0.5MM]  (no BOM)
J17  IOPAD  [SMT_IO_PAD_2x1MM]  (no BOM)
J18  IOPAD  [SMT_IO_PAD_2x1MM]  (no BOM)
J22  IOPAD  [SMT_IO_PAD_4x2MM]  (no BOM)
J23  IOPAD  [SMT_IO_PAD_4x2MM]  (no BOM)
P1  M2.5-6.3mm pad  [MH6.3-2_7MM]  (value not drawn)  (no BOM)
P2  M2.5-6.3mm pad  [MH6.3-2_7MM]  (value not drawn)  (no BOM)
P3  M2.5-6.3mm pad  [MH6.3-2_7MM]  (value not drawn)  (no BOM)
P4  M2.5-6.3mm pad  [MH6.3-2_7MM]  (value not drawn)  (no BOM)
P5  M2.5-6.3mm pad  [MH6.3-2_7MM]  (value not drawn)  (no BOM)
P6  M2.5-6.3mm pad  [MH6.3-2_7MM]  (value not drawn)  (no BOM)
P7  M2.5-6.3mm pad  [MH6.3-2_7MM]  (value not drawn)  (no BOM)
P8  M2.5-6.3mm pad  [MH6.3-2_7MM]  (value not drawn)  (no BOM)
P9  M2.5-6.3mm pad  [MH6.3-2_7MM]  (value not drawn)  (no BOM)
P10  M2.5-6.3mm pad  [MH6.3-2_7MM]  (value not drawn)  (no BOM)
P11  M2.5-6.3mm pad  [MH6.3-2_7MM]  (value not drawn)  (no BOM)
P12  M2.5-6.3mm pad  [MH6.3-2_7MM]  (value not drawn)  (no BOM)
P13  M2.5-6.3mm pad  [MH6.3-2_7MM]  (value not drawn)  (no BOM)
P14  M2.5-6.3mm pad  [MH6.3-2_7MM]  (value not drawn)  (no BOM)
P15  M2.5-6.3mm pad  [MH6.3-2_7MM]  (value not drawn)  (no BOM)
P16  M2.5-6.3mm pad  [MH6.3-2_7MM]  (value not drawn)  (no BOM)
P17  M2.5-6.3mm pad  [MH6.3-2_7MM]  (value not drawn)  (no BOM)
P18  M2.5-6.3mm pad  [MH6.3-2_7MM]  (value not drawn)  (no BOM)
P19  M2.5-6.3mm pad  [MH6.3-2_7MM]  (value not drawn)  (no BOM)
P20  M2.5-6.3mm pad  [MH6.3-2_7MM]  (value not drawn)  (no BOM)
P26  M2.5-6.3mm pad  [MH6.3-2_7MM]  (value not drawn)  (no BOM)
P27  M2.5-6.3mm pad  [MH6.3-2_7MM]  (value not drawn)  (no BOM)
P28  M2.5-6.3mm pad  [MH6.3-2_7MM]  (value not drawn)  (no BOM)
P29  M2.5-6.3mm pad  [MH6.3-2_7MM]  (value not drawn)  (no BOM)
PCB1  LOGO-FULL-SILK  [LOGO-FULL-SILK]  (no BOM)
PCB2  0021-03  [PCBNo_SILK]
R1  200R 1% 0603  [RESC1608N]
R2  200R 1% 0603  [RESC1608N]
R3  0R0 Jumper 0603  [RESC1608N]
R4  0R0 Jumper 0603  [RESC1608N]
TP1  S1751-46  [S1751-46]
TP2  S1751-46  [S1751-46]
TP3  S1751-46  [S1751-46]
TP4  S1751-46  [S1751-46]
TP5  S1751-46  [S1751-46]
TP7  S1751-46  [S1751-46]
TP8  S1751-46  [S1751-46]
TP9  S1751-46  [S1751-46]
TP10  S1751-46  [S1751-46]

### Sub-sheets
ADC_NORTH = [2] ADC.SchDoc (file not in this document): SYNC_P (in), SYNC_N (in), CLK_P (in), CLK_N (in), A_DATA (harness ADC Port), B_DATA (harness ADC Port), C_DATA (harness ADC Port), D_DATA (harness ADC Port), DI (in), AI (in), BI (in), CI (in), SPI_ADC (harness SPI_ADC), +3V3A, GND, +1V8, MON_ADC (harness MON_ADC), +2V5
ADC_SOUTH = [2] ADC.SchDoc (file not in this document): SYNC_P (in), SYNC_N (in), CLK_P (in), CLK_N (in), A_DATA (harness ADC Port), B_DATA (harness ADC Port), C_DATA (harness ADC Port), D_DATA (harness ADC Port), DI (in), AI (in), BI (in), CI (in), SPI_ADC (harness SPI_ADC), +3V3A, GND, +1V8, MON_ADC (harness MON_ADC), +2V5
Clock = [6] CLOCK.SchDoc (file not in this document): EXT_CLK (in), N_CLK_P (out), N_CLK_N (out), S_CLK_P (out), S_CLK_N (out), +3V3, +2V5, GND, SPI_FS (harness SPI_FS), FPGA_CLK_P (out), FPGA_CLK_N (out)
ETH = [7] ETH.SchDoc (file not in this document): +2V5, +1V0, GND, +3V3, ETH_SMI (harness ETH_SMI), ETH_D3_P (out), ETH_D2_P (out), ETH_D2_N (out), ETH_D3_N (out), ETH_D0_N (out), ETH_RGMII (harness ETH_RGMII), ETH_D1_P (out), ETH_D0_P (out), ETH_D1_N (out), ETH_SPD (out), ETH_ACT (out)
FPGA = [8] FPGA.SchDoc (file not in this document): NA_DATA (harness ADC Port), NB_DATA (harness ADC Port), NC_DATA (harness ADC Port), SA_DATA (harness ADC Port), ND_DATA (harness ADC Port), SB_DATA (harness ADC Port), SC_DATA (harness ADC Port), SD_DATA (harness ADC Port), ADC_SYNC_P (out), ADC_SYNC_N (out), +1V0, GND, +2V5, +3V3, MON_ADC_S (harness MON_ADC), MON_ADC_N (harness MON_ADC), FPGA_CLK_N (in), FPGA_CLK_P (in), SPI_FS (harness SPI_FS), SPI_ADC_S (harness SPI_ADC), SPI_ADC_N (harness SPI_ADC), JTAG (harness USB JTAG), JTAG_TCSN (in), USB (harness USB FIFO), GPI[3..0] (in), ETH_SMI (harness ETH_SMI), ETH_RGMII (harness ETH_RGMII), GPO[3..0] (in), TEMP_PWR_rtn, TEMP_PWR
POWER = [16] POWER.SchDoc (file not in this document): +3V3A, +3V3, +2V5, +1V8, +1V0, UIN, GND, TEMP_PWR_rtn, TEMP_PWR
USB = [21] USB.SchDoc (file not in this document): USB_PWREN (out), USB_D_N (in), USB_D_P (in), JTAG (harness USB JTAG), USB (harness USB FIFO), +3V3, GND

### Nets
+1V0: sheet FPGA/+1V0, sheet ETH/+1V0, sheet POWER/+1V0
+1V8: sheet ADC_SOUTH/+1V8, sheet ADC_NORTH/+1V8, sheet POWER/+1V8
+2V5: J1.2 J1.14 ; sheet ADC_SOUTH/+2V5, sheet Clock/+2V5, sheet FPGA/+2V5, sheet ADC_NORTH/+2V5, sheet ETH/+2V5, sheet POWER/+2V5
+3V3: sheet Clock/+3V3, sheet USB/+3V3, sheet FPGA/+3V3, sheet ETH/+3V3, sheet POWER/+3V3
+3V3A: sheet ADC_SOUTH/+3V3A, sheet ADC_NORTH/+3V3A, sheet POWER/+3V3A
GND: F3.1 F4.1 J11.1 J23.1 P1.MH P2.MH P3.MH P4.MH P5.MH P6.MH P7.MH P8.MH P9.MH P10.MH P11.MH P12.MH P13.MH P14.MH P15.MH P16.MH P17.MH P18.MH P19.MH P20.MH P26.MH P27.MH P28.MH P29.MH R3.1 R4.1 TP1.1 TP2.1 TP3.1 TP4.1 TP5.1 TP7.1 TP8.1 TP9.1 TP10.1 ; sheet ADC_SOUTH/GND, sheet Clock/GND, sheet USB/GND, sheet FPGA/GND, sheet ADC_NORTH/GND, sheet ETH/GND, sheet POWER/GND
ETH_ACT: R2.2 ; sheet ETH/ETH_ACT
ETH_D0_N: J1.4(D1-) ; sheet ETH/ETH_D0_N
ETH_D0_P: J1.3(D1+) ; sheet ETH/ETH_D0_P
ETH_D1_N: J1.6(D2-) ; sheet ETH/ETH_D1_N
ETH_D1_P: J1.5(D2+) ; sheet ETH/ETH_D1_P
ETH_D2_N: J1.8(D3-) ; sheet ETH/ETH_D2_N
ETH_D2_P: J1.7(D3+) ; sheet ETH/ETH_D2_P
ETH_D3_N: J1.10(D4-) ; sheet ETH/ETH_D3_N
ETH_D3_P: J1.9(D4+) ; sheet ETH/ETH_D3_P
ETH_SPD: R1.2 ; sheet ETH/ETH_SPD
GPI0: J11.5
GPI1: J11.4
GPI2: J11.3
GPI3: J11.2
GPO0: J11.6
GPO1: J11.7
GPO2: J11.8
GPO3: J11.9
TEMP_PWR: sheet FPGA/TEMP_PWR, sheet POWER/TEMP_PWR
TEMP_PWR_rtn: sheet FPGA/TEMP_PWR_rtn, sheet POWER/TEMP_PWR_rtn
UIN: J22.1 ; sheet POWER/UIN
NetF3_2: F3.2 J1.S1(Shield) J1.S2(Shield)
NetF4_2: F4.2 J10.Shell(Shield)
NetJ1_1: J1.1 R2.1
NetJ1_11: J1.11(VCC) J17.1
NetJ1_12: J1.12(GND) R3.2
NetJ1_13: J1.13 R1.1
NetJ2_1: J2.1 ; sheet ADC_NORTH/AI
NetJ3_1: J3.1 ; sheet ADC_NORTH/BI
NetJ4_1: J4.1 ; sheet ADC_NORTH/CI
NetJ5_1: J5.1 ; sheet ADC_NORTH/DI
NetJ6_1: J6.1 ; sheet ADC_SOUTH/AI
NetJ7_1: J7.1 ; sheet ADC_SOUTH/BI
NetJ8_1: J8.1 ; sheet ADC_SOUTH/CI
NetJ9_1: J9.1 ; sheet ADC_SOUTH/DI
NetJ10_A1: J10.A1(GND) J10.A12(GND) J10.B1(GND) J10.B12(GND) J10.G1(GND) J10.G2(GND) R4.2
NetJ10_A4: J10.A4(VBUS) J10.A9(VBUS) J10.B4(VBUS) J10.B9(VBUS) J18.1
NetJ10_A6: J10.A6(Dp1) J10.B6(Dp2) ; sheet USB/USB_D_P
NetJ10_A7: J10.A7(Dn1) J10.B7(Dn2) ; sheet USB/USB_D_N
NetJ15_1: J15.1 ; sheet Clock/EXT_CLK
(unnamed): sheet ADC_SOUTH/SYNC_P, sheet FPGA/ADC_SYNC_P, sheet ADC_NORTH/SYNC_P
(unnamed): sheet ADC_SOUTH/SYNC_N, sheet FPGA/ADC_SYNC_N, sheet ADC_NORTH/SYNC_N
(unnamed): sheet ADC_SOUTH/CLK_P, sheet Clock/S_CLK_P
(unnamed): sheet ADC_SOUTH/CLK_N, sheet Clock/S_CLK_N
(unnamed): sheet Clock/N_CLK_P, sheet ADC_NORTH/CLK_P
(unnamed): sheet Clock/N_CLK_N, sheet ADC_NORTH/CLK_N
(unnamed): sheet Clock/FPGA_CLK_P, sheet FPGA/FPGA_CLK_P
(unnamed): sheet Clock/FPGA_CLK_N, sheet FPGA/FPGA_CLK_N
(unnamed): sheet USB/USB_PWREN, sheet FPGA/JTAG_TCSN

Not connected (* = marked no-connect by the designer): J10 A2(SSTXp1) A3(SSTXn1) A5(CC1) A8(SBU1) A10(SSRXn2) A11(SSRXp2) B2(SSTXp2) B3(SSTXn2) B5(CC2) B8(SBU2) B10(SSRXn1) B11(SSRXp1); J11 10

### Buses and harness runs
bus GPI[3..0] = sheet FPGA/GPI[3..0]
bus GPO[3..0] = sheet FPGA/GPO[3..0]
harness ETH_RGMII = sheet ETH/ETH_RGMII = sheet FPGA/ETH_RGMII
harness ETH_SMI = sheet ETH/ETH_SMI = sheet FPGA/ETH_SMI
harness JTAG = sheet FPGA/JTAG = sheet USB/JTAG
harness MON_ADC_N = sheet ADC_NORTH/MON_ADC = sheet FPGA/MON_ADC_N
harness MON_ADC_S = sheet ADC_SOUTH/MON_ADC = sheet FPGA/MON_ADC_S
harness NA = sheet ADC_NORTH/A_DATA = sheet FPGA/NA_DATA
harness NB = sheet ADC_NORTH/B_DATA = sheet FPGA/NB_DATA
harness NC = sheet ADC_NORTH/C_DATA = sheet FPGA/NC_DATA
harness ND = sheet ADC_NORTH/D_DATA = sheet FPGA/ND_DATA
harness SA = sheet ADC_SOUTH/A_DATA = sheet FPGA/SA_DATA
harness SB = sheet ADC_SOUTH/B_DATA = sheet FPGA/SB_DATA
harness SC = sheet ADC_SOUTH/C_DATA = sheet FPGA/SC_DATA
harness SD = sheet ADC_SOUTH/D_DATA = sheet FPGA/SD_DATA
harness SPI_ADC_N = sheet ADC_NORTH/SPI_ADC = sheet FPGA/SPI_ADC_N
harness SPI_ADC_S = sheet ADC_SOUTH/SPI_ADC = sheet FPGA/SPI_ADC_S
harness SPI_FS = sheet Clock/SPI_FS = sheet FPGA/SPI_FS
harness USB = sheet FPGA/USB = sheet USB/USB

### Notes on the sheet
- 214-502SF, 290-14G <https://mpd.southwestmicrowave.com/product/214-502sf-supersma-jack-female-2-hole-625-long/>
- Title:
- SVN:
- August Barks gata 6B
- SE-421 32 Västra Frölunda
- Omnisys Instruments AB
- PCB ASY:
- PCB:
- SVN Folder:
- www.omnisys.se
- Page:
- of
- Print date:
- Page size:
- A3
- Information contained in this drawing is confidential. Copying, distributing or use in any matter, other than that specified by OMNISYS INSTRUMENTS AB, is strictly prohibited.
- (in symbol CMP-4700-000000-3) Silkscreen; 0000-00

### Library data of the parts
F3 F4 = CMP-0600-000010-2: as F1 on sheet [13] FPGA_PWR; Z@Freq: 30.0 Ω  @  100.0MHz; PartNumber: 74279206
FID1-FID3 = CMP-1600-000001-2: Pick and place fiducial
J1 = CMP-1000-000522-2: CONN MAGJACK 1PORT 1000 BASE-T; PartNumber: 7498111120AR; Pitch: 2.54mm; Gender: Female; Number of Positions: 8; Shielding: Shielded; Direction: Up; Number of Ports: 1; Connector Type: RJ45; Mount: Surface Mount,Edge; Color: Green,Yellow,Black; Contact Plating: Gold; Housing Material: Polymer; Package Quantity: 100; Max Operating Temperature: 70°C; Number of Rows: 1; Termination: SMD/SMT; Packaging: Tape and Reel; Mounting type: SMD; Lead Free: Lead Free; Number of Cores per Jack: 8; Min Operating Temperature: 0°C; REACH SVHC: Unknown; Number of Contacts: 8; Rows: 1; Pins: 14; Contact Material: Bronze
J2-J9 J15 = CMP-1000-000525-1: Square IO pad 0.5x0.5mm used for test points and flying leads.
J10 = CMP-1502-03214-1: USB 3.1 Type C Receptacle WR-COM, Horizontal, SMT / THT; Manufacturer: Wurth Elektronik; Rated Current: 5A; Contact Resistance: 30mOhm; Working Voltage: 20VDC; Operating Temperature: -40to105degC; Package Reference: 632723300011; Datasheet URL: https://katalog.we-online.de/em/datasheet/632723x00011%282%29.pdf; Manufacturer URL: http://www.we-online.de; Connector Type: USB3.1TypeC; Gender: Receptacle; Part Number: 632723300011; Mounting Technology: SMT/THT; Publisher: WurthElektronik; Packaging: TapeandReel; Orientation: Horizontal
J11 = CMP-1000-000523-2: CONN HDR 1.25MM R/A PCB 10POS; Row Spacing: 0.049inch; Number of Positions: 10; Rows: 2; Connector Type: Male Pin; Contact Plating: Gold; Number of Rows: 2; Number of Pins: 10; Mount: Through Hole; Color: Green; Termination: Solder; Pins: 10; Pitch: 0.049inch; Packaging: Cut Strip
J17 J18 J22 J23 = CMP-1000-000152-5: IO pad used for test points and flying leads.
P1-P20 P26-P29 = CMP-1600-000026-1: Mounting hole, M2.5-6.3mm pad
PCB1 = CMP-4700-000008-1: Full logo in Silkscreen
PCB2 = CMP-4700-000000-3: PCB part number, silkscreen layer
R1 R2 = CMP-1800-002005-5: Thick film Chip Resistor, 0603/1608; Value: 200; Power: 100mW; Maximum working voltage: 75V; Temp. Coefficent: 0.01%; Tolerance: 1%; Case/Package: 0603/1608; Composition: Thick film
R3 R4 = CMP-1800-001949-5: Thick film Chip Resistor, 0603/1608; Value: 0; Tolerance: 0%; Power: 0W; Maximum working voltage: 75V; Temp. Coefficent: 0%; Case/Package: 0603/1608; Composition: Thick film
TP1-TP5 TP7-TP10 = CMP-3600-000004-2: SMD Test point clip; PartNumber: S1751-46

## Sheet Sheet1-Renamed123.SchDoc
size A
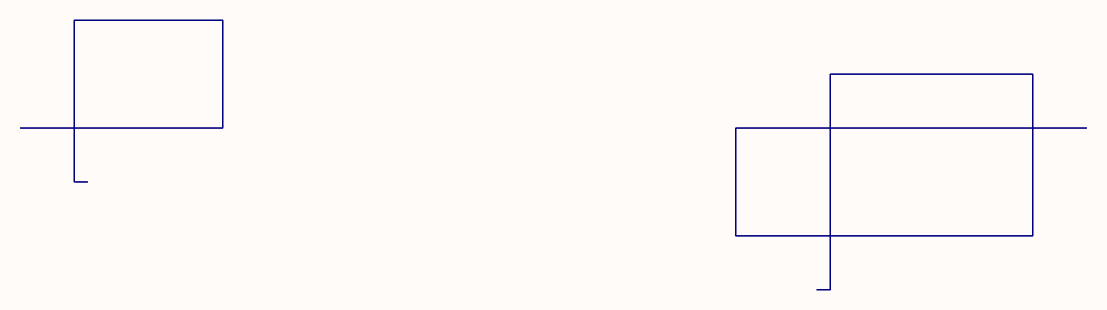
[diagram p3: Sheet1-Renamed123.SchDoc]

## Assembly variants
Design Variant: not fitted C72 C73 C74 C75 C76 C77 C78 C79 C80 C81 C82 C83 F3 F12 F13 J1 J2 J3 J4 J5 J6 J7 J8 J9 J12.1 J12.2 J12.3 J12.4 J13.1 J13.2 J13.3 J13.4 J14.1 J14.2 J14.3 J14.4 J15 J16.1 J16.2 J16.3 J16.4 J17 J18 J19 J20.1 J20.2 J20.3 J20.4 J21.1 J21.2 J21.3 J21.4 J22 J23 P1 P2 P3 P4 P5 P6 P7 P8 P9 P10 P11 P12 P13 P14 P15 P16 P17 P18 P19 P20 P21 P22 P23 P24 P25 P26 P27 P28 P29 PCB1 PCB2 R1 R2 R3 R31 R35 R38 R49 R50 R51 R52 R53 R54 R55 R56 R57 R84 R85 R86 R87 R88 R89 R90 R91 R130.1 R130.2 R130.3 R130.4 R131.1 R131.2 R131.3 R131.4 R138 R139 U13 X3; alternate parts C200.2 -> CMP-0300-002446-6, C201.2 -> CMP-0300-002453-6, R132.2 -> CMP-1800-002039-5, R132.1 -> CMP-1800-002412-4, C200.3 -> CMP-0300-002446-6, C201.3 -> CMP-0300-002453-6, R132.3 -> CMP-1800-002042-5, C200.4 -> CMP-0300-002445-6, C201.4 -> CMP-0300-002450-6, R132.4 -> CMP-1800-002047-5, C200.1 -> CMP-0300-002447-6, C201.1 -> CMP-0300-002454-6, R48.2 -> CMP-1800-002464-4, R48.3 -> CMP-1800-002469-4, R48.4 -> CMP-1800-002442-4, C199.4 -> CMP-0300-002107-6